# Altium schematic sheet ELC102 - Switch Interface.SchDoc
size D
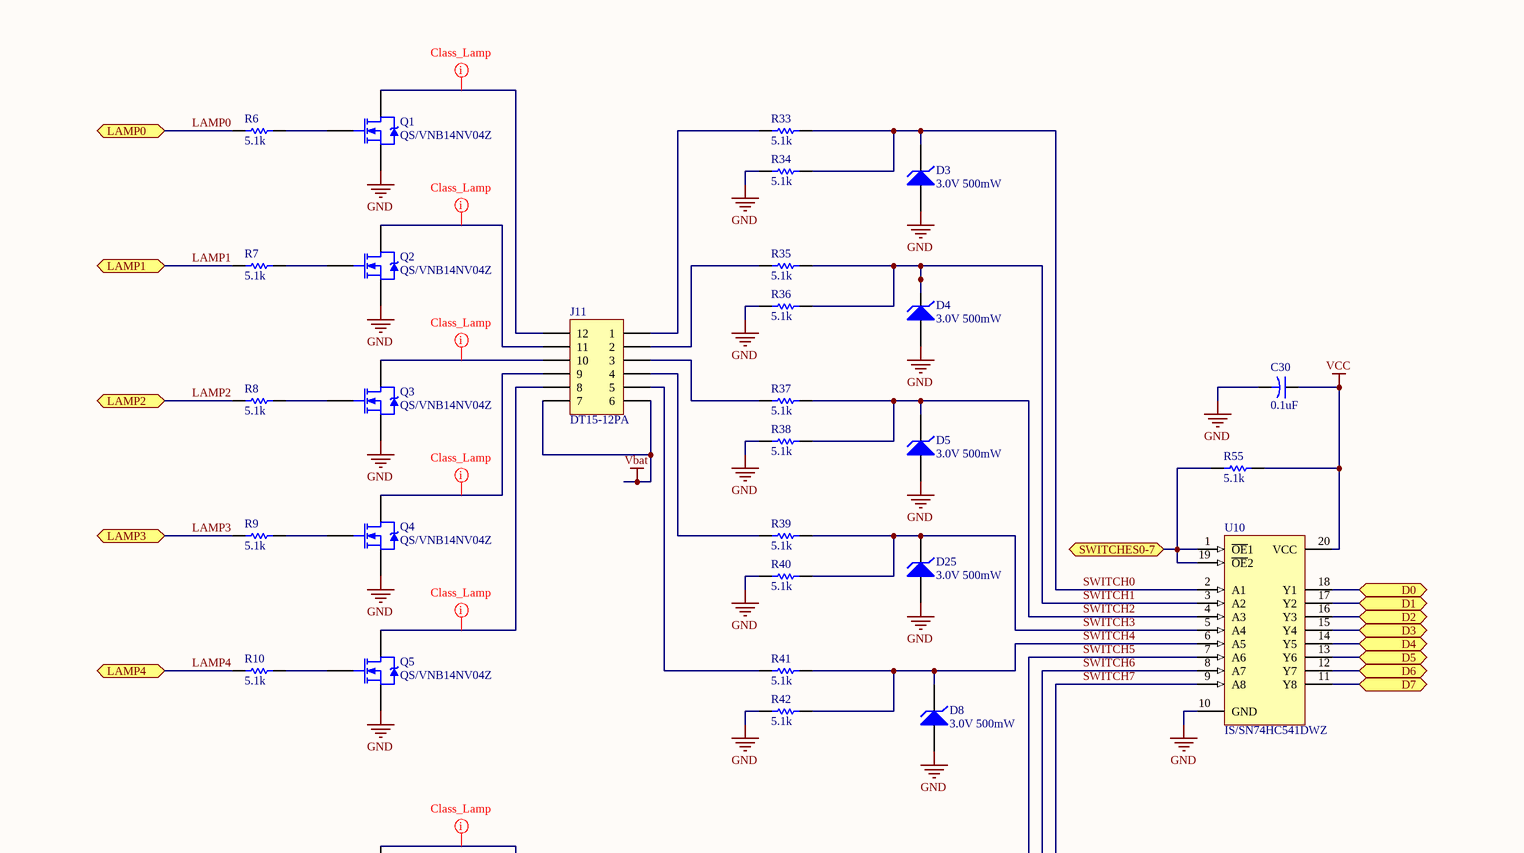
[diagram p0: ELC102 - Switch Interface.SchDoc, top left]
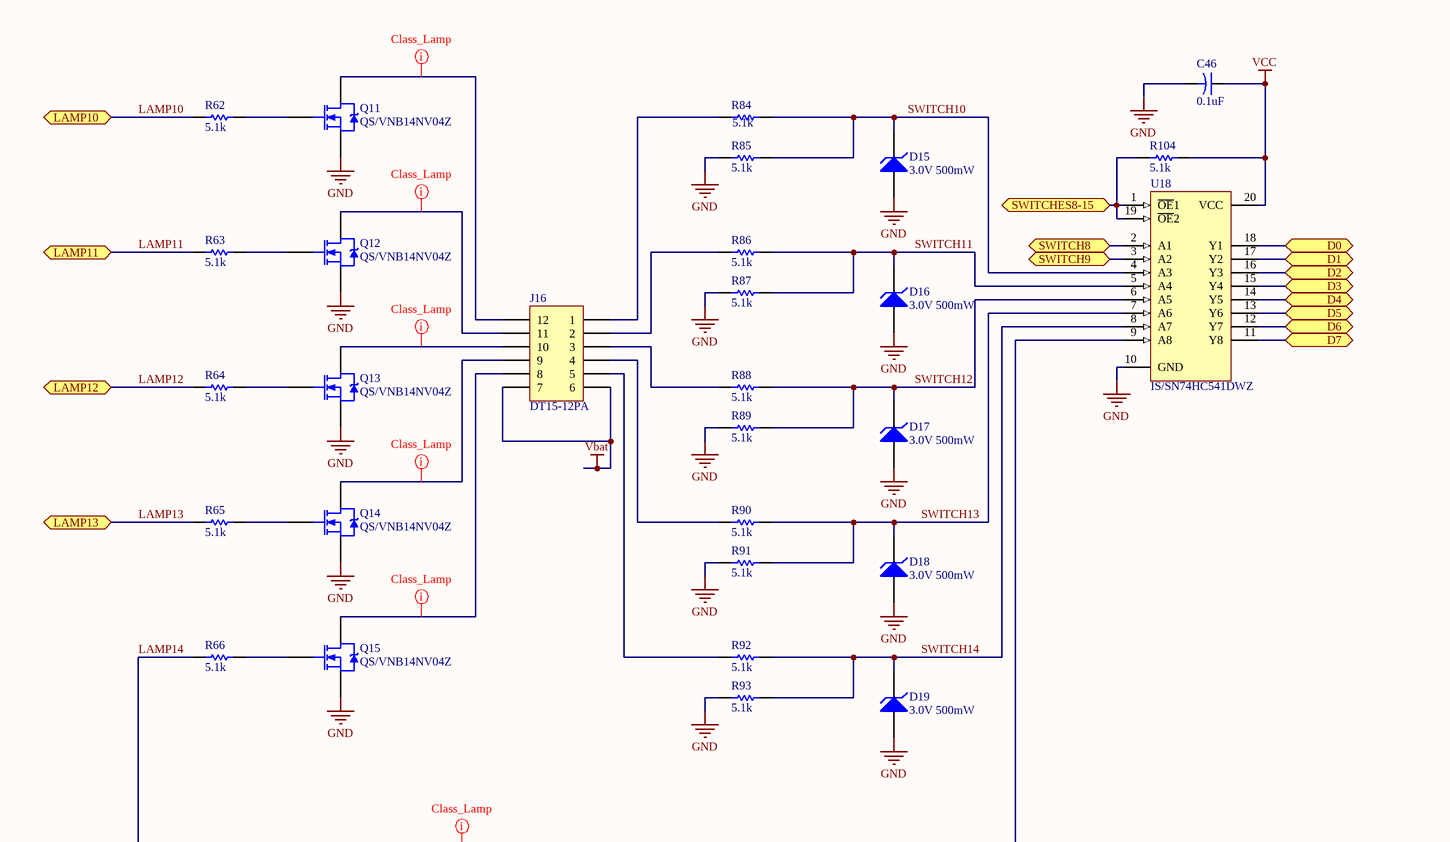
[diagram p1: ELC102 - Switch Interface.SchDoc, top right]
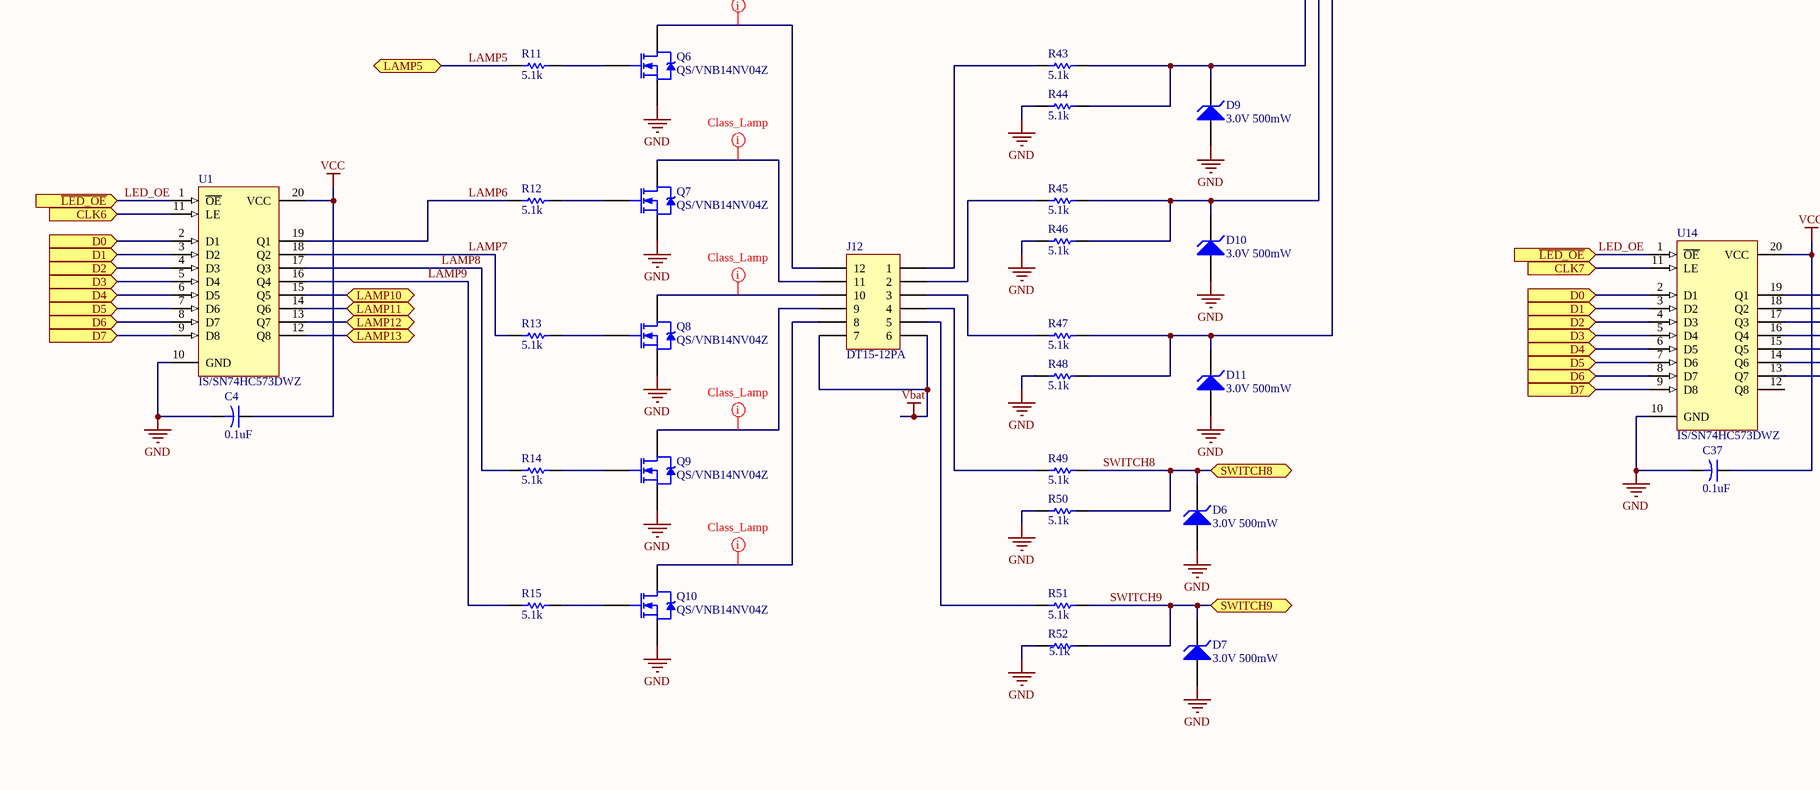
[diagram p2: ELC102 - Switch Interface.SchDoc, bottom left]
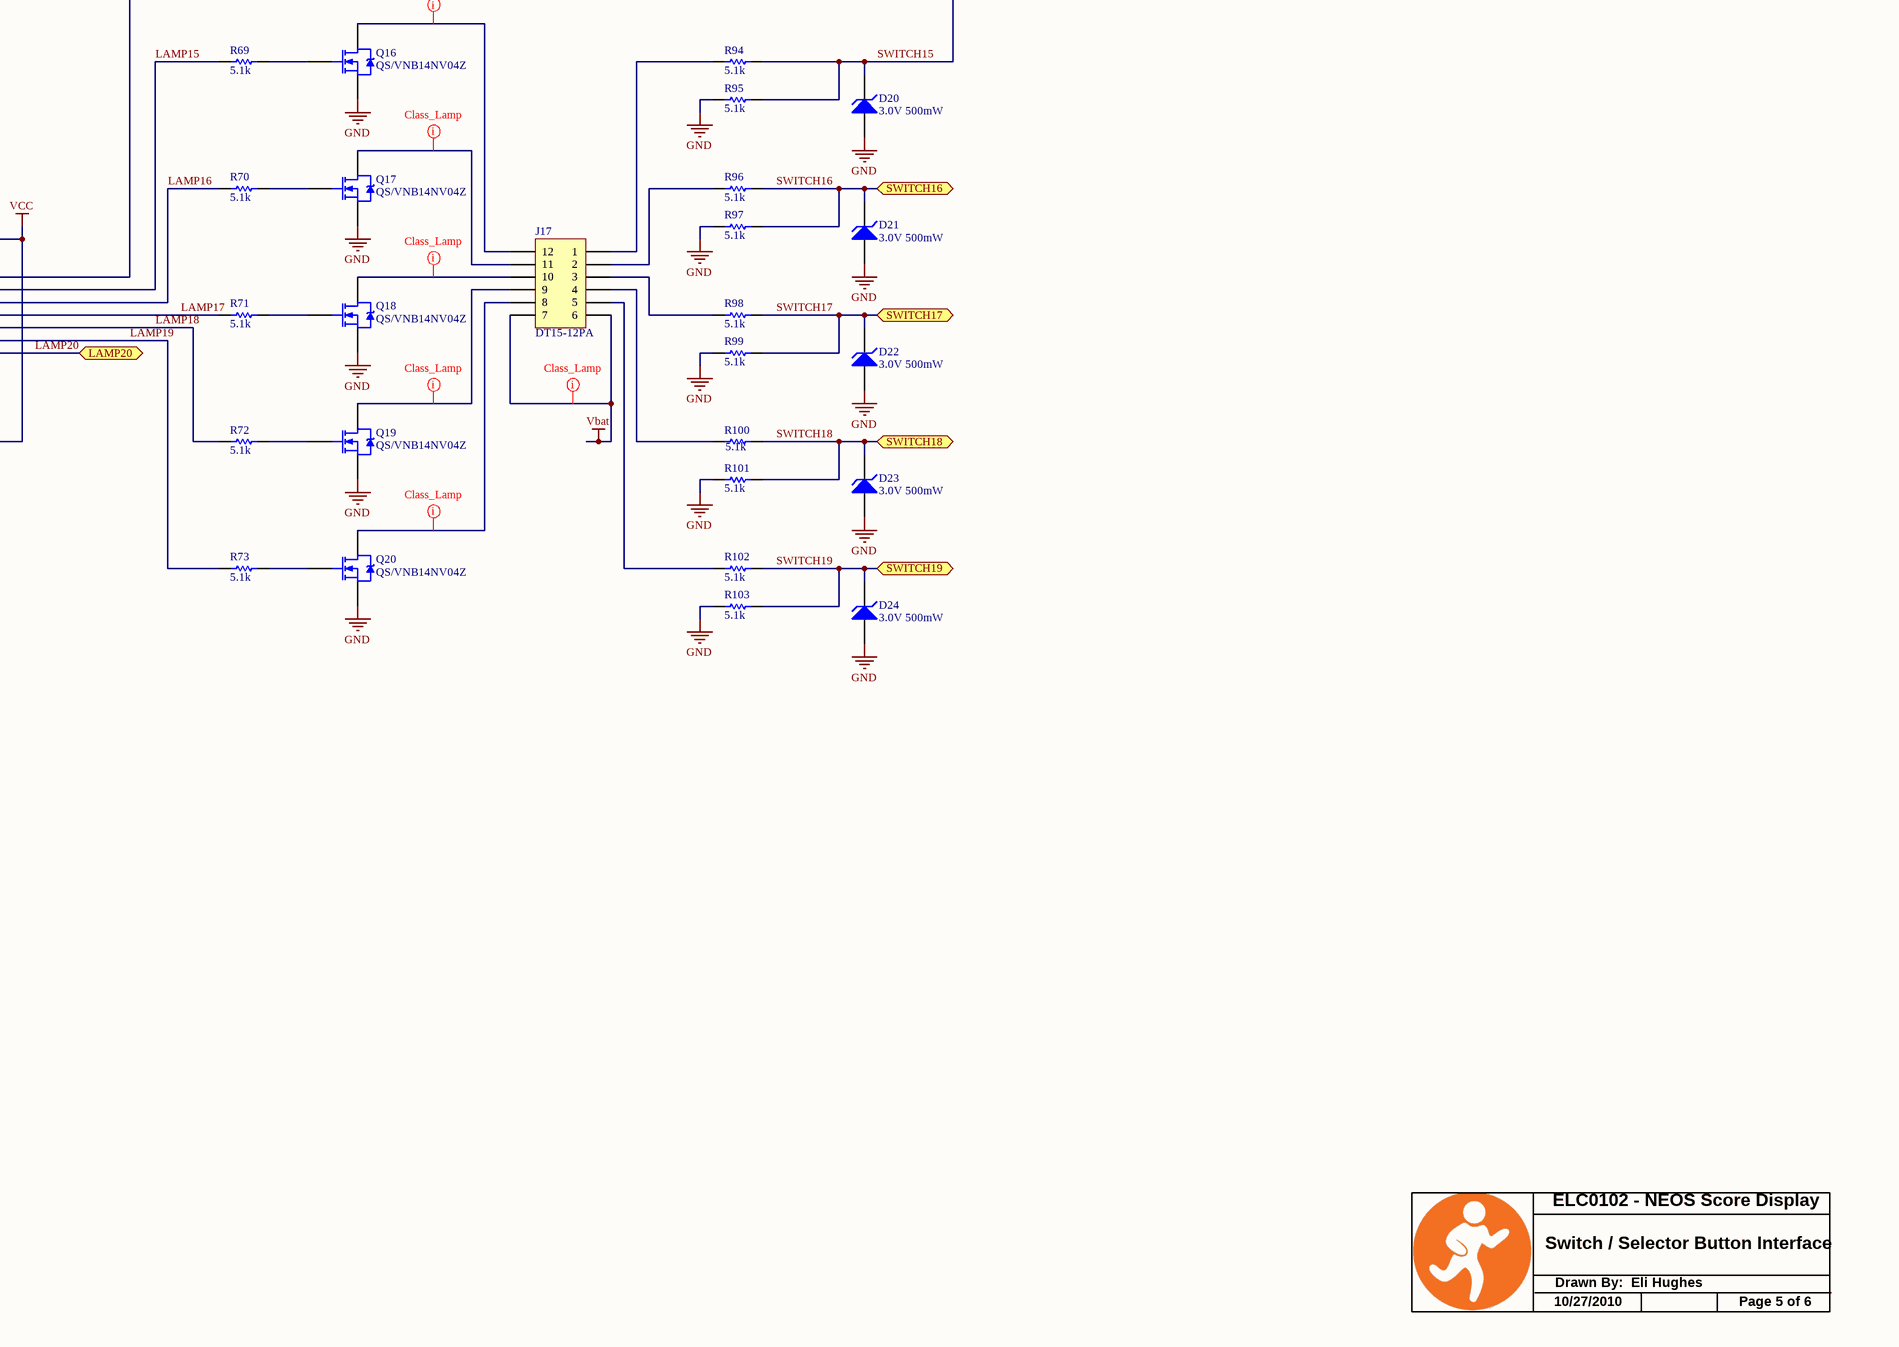
[diagram p3: ELC102 - Switch Interface.SchDoc, bottom right]

## Parts
C4  0.1uF  [C0805]
C30  0.1uF  [C0805]
C37  0.1uF  [C0805]
C46  0.1uF  [C0805]
D3  3.0V 500mW  [SOD123]
D4  3.0V 500mW  [SOD123]
D5  3.0V 500mW  [SOD123]
D6  3.0V 500mW  [SOD123]
D7  3.0V 500mW  [SOD123]
D8  3.0V 500mW  [SOD123]
D9  3.0V 500mW  [SOD123]
D10  3.0V 500mW  [SOD123]
D11  3.0V 500mW  [SOD123]
D15  3.0V 500mW  [SOD123]
D16  3.0V 500mW  [SOD123]
D17  3.0V 500mW  [SOD123]
D18  3.0V 500mW  [SOD123]
D19  3.0V 500mW  [SOD123]
D20  3.0V 500mW  [SOD123]
D21  3.0V 500mW  [SOD123]
D22  3.0V 500mW  [SOD123]
D23  3.0V 500mW  [SOD123]
D24  3.0V 500mW  [SOD123]
D25  3.0V 500mW  [SOD123]
J11  DT15-12PA  [JDT1512PA00Z]
J12  DT15-12PA  [JDT1512PA00Z]
J16  DT15-12PA  [JDT1512PA00Z]
J17  DT15-12PA  [JDT1512PA00Z]
Q1  QS/VNB14NV04Z  [D2PAK]
Q2  QS/VNB14NV04Z  [D2PAK]
Q3  QS/VNB14NV04Z  [D2PAK]
Q4  QS/VNB14NV04Z  [D2PAK]
Q5  QS/VNB14NV04Z  [D2PAK]
Q6  QS/VNB14NV04Z  [D2PAK]
Q7  QS/VNB14NV04Z  [D2PAK]
Q8  QS/VNB14NV04Z  [D2PAK]
Q9  QS/VNB14NV04Z  [D2PAK]
Q10  QS/VNB14NV04Z  [D2PAK]
Q11  QS/VNB14NV04Z  [D2PAK]
Q12  QS/VNB14NV04Z  [D2PAK]
Q13  QS/VNB14NV04Z  [D2PAK]
Q14  QS/VNB14NV04Z  [D2PAK]
Q15  QS/VNB14NV04Z  [D2PAK]
Q16  QS/VNB14NV04Z  [D2PAK]
Q17  QS/VNB14NV04Z  [D2PAK]
Q18  QS/VNB14NV04Z  [D2PAK]
Q19  QS/VNB14NV04Z  [D2PAK]
Q20  QS/VNB14NV04Z  [D2PAK]
R6  5.1k  [R0805]
R7  5.1k  [R0805]
R8  5.1k  [R0805]
R9  5.1k  [R0805]
R10  5.1k  [R0805]
R11  5.1k  [R0805]
R12  5.1k  [R0805]
R13  5.1k  [R0805]
R14  5.1k  [R0805]
R15  5.1k  [R0805]
R33  5.1k  [R0805]
R34  5.1k  [R0805]
R35  5.1k  [R0805]
R36  5.1k  [R0805]
R37  5.1k  [R0805]
R38  5.1k  [R0805]
R39  5.1k  [R0805]
R40  5.1k  [R0805]
R41  5.1k  [R0805]
R42  5.1k  [R0805]
R43  5.1k  [R0805]
R44  5.1k  [R0805]
R45  5.1k  [R0805]
R46  5.1k  [R0805]
R47  5.1k  [R0805]
R48  5.1k  [R0805]
R49  5.1k  [R0805]
R50  5.1k  [R0805]
R51  5.1k  [R0805]
R52  5.1k  [R0805]
R55  5.1k  [R0805]
R62  5.1k  [R0805]
R63  5.1k  [R0805]
R64  5.1k  [R0805]
R65  5.1k  [R0805]
R66  5.1k  [R0805]
R69  5.1k  [R0805]
R70  5.1k  [R0805]
R71  5.1k  [R0805]
R72  5.1k  [R0805]
R73  5.1k  [R0805]
R84  5.1k  [R0805]
R85  5.1k  [R0805]
R86  5.1k  [R0805]
R87  5.1k  [R0805]
R88  5.1k  [R0805]
R89  5.1k  [R0805]
R90  5.1k  [R0805]
R91  5.1k  [R0805]
R92  5.1k  [R0805]
R93  5.1k  [R0805]
R94  5.1k  [R0805]
R95  5.1k  [R0805]
R96  5.1k  [R0805]
R97  5.1k  [R0805]
R98  5.1k  [R0805]
R99  5.1k  [R0805]
R100  5.1k  [R0805]
R101  5.1k  [R0805]
R102  5.1k  [R0805]
R103  5.1k  [R0805]
R104  5.1k  [R0805]
U1  IS/SN74HC573DWZ  [SOIC300-20]
U10  IS/SN74HC541DWZ  [SOIC300-20]
U14  IS/SN74HC573DWZ  [SOIC300-20]
U18  IS/SN74HC541DWZ  [SOIC300-20]

## Ports
CLK6 (in), CLK7 (in), D0, D0 (in), D1, D1 (in), D2, D2 (in), D3, D3 (in), D4, D4 (in), D5, D5 (in), D6, D6 (in), D7, D7 (in), LAMP0, LAMP1, LAMP2, LAMP3, LAMP4, LAMP5, LAMP10, LAMP11, LAMP12, LAMP13, LAMP20, SWITCH8, SWITCH9, SWITCH16, SWITCH17, SWITCH18, SWITCH19, SWITCHES0-7, SWITCHES8-15, ~{LED_OE} (in)

## Nets
GND: C4.2 C30.2 C37.2 C46.2 D3.1(A) D4.1(A) D5.1(A) D6.1(A) D7.1(A) D8.1(A) D9.1(A) D10.1(A) D11.1(A) D15.1(A) D16.1(A) D17.1(A) D18.1(A) D19.1(A) D20.1(A) D21.1(A) D22.1(A) D23.1(A) D24.1(A) D25.1(A) Q1.3(S) Q2.3(S) Q3.3(S) Q4.3(S) Q5.3(S) Q6.3(S) Q7.3(S) Q8.3(S) Q9.3(S) Q10.3(S) Q11.3(S) Q12.3(S) Q13.3(S) Q14.3(S) Q15.3(S) Q16.3(S) Q17.3(S) Q18.3(S) Q19.3(S) Q20.3(S) R34.2 R36.2 R38.2 R40.2 R42.2 R44.2 R46.2 R48.2 R50.2 R52.2 R85.2 R87.2 R89.2 R91.2 R93.2 R95.2 R97.2 R99.2 R101.2 R103.2 U1.10(GND) U10.10(GND) U14.10(GND) U18.10(GND)
Vbat: J11.6 J11.7 J12.6 J12.7 J16.6 J16.7 J17.6 J17.7
VCC: C4.1 C30.1 C37.1 C46.1 R55.1 R104.1 U1.20(VCC) U10.20(VCC) U14.20(VCC) U18.20(VCC)
CLK6: U1.11(LE) ; port CLK6
CLK7: U14.11(LE) ; port CLK7
D0: U1.2(D1) U10.18(Y1) U14.2(D1) U18.18(Y1) ; port D0
D1: U1.3(D2) U10.17(Y2) U14.3(D2) U18.17(Y2) ; port D1
D2: U1.4(D3) U10.16(Y3) U14.4(D3) U18.16(Y3) ; port D2
D3: U1.5(D4) U10.15(Y4) U14.5(D4) U18.15(Y4) ; port D3
D4: U1.6(D5) U10.14(Y5) U14.6(D5) U18.14(Y5) ; port D4
D5: U1.7(D6) U10.13(Y6) U14.7(D6) U18.13(Y6) ; port D5
D6: U1.8(D7) U10.12(Y7) U14.8(D7) U18.12(Y7) ; port D6
D7: U1.9(D8) U10.11(Y8) U14.9(D8) U18.11(Y8) ; port D7
LAMP0: R6.1 ; port LAMP0
LAMP1: R7.1 ; port LAMP1
LAMP2: R8.1 ; port LAMP2
LAMP3: R9.1 ; port LAMP3
LAMP4: R10.1 ; port LAMP4
LAMP5: R11.1 ; port LAMP5
LAMP6: R12.1 U1.19(Q1)
LAMP7: R13.1 U1.18(Q2)
LAMP8: R14.1 U1.17(Q3)
LAMP9: R15.1 U1.16(Q4)
LAMP10: R62.1 U1.15(Q5) ; port LAMP10
LAMP11: R63.1 U1.14(Q6) ; port LAMP11
LAMP12: R64.1 U1.13(Q7) ; port LAMP12
LAMP13: R65.1 U1.12(Q8) ; port LAMP13
LAMP14: R66.1 U14.19(Q1)
LAMP15: R69.1 U14.18(Q2)
LAMP16: R70.1 U14.17(Q3)
LAMP17: R71.1 U14.16(Q4)
LAMP18: R72.1 U14.15(Q5)
LAMP19: R73.1 U14.14(Q6)
LAMP20: U14.13(Q7) ; port LAMP20
LED_OE: U1.1(~{OE}) U14.1(~{OE}) ; port ~{LED_OE}
SWITCH0: D3.2(K) R33.1 R34.1 U10.2(A1)
SWITCH1: D4.2(K) R35.1 R36.1 U10.3(A2)
SWITCH2: D5.2(K) R37.1 R38.1 U10.4(A3)
SWITCH3: D25.2(K) R39.1 R40.1 U10.5(A4)
SWITCH4: D8.2(K) R41.1 R42.1 U10.6(A5)
SWITCH5: D9.2(K) R43.1 R44.1 U10.7(A6)
SWITCH6: D10.2(K) R45.1 R46.1 U10.8(A7)
SWITCH7: D11.2(K) R47.1 R48.1 U10.9(A8)
SWITCH8: D6.2(K) R49.1 R50.1 U18.2(A1) ; port SWITCH8
SWITCH9: D7.2(K) R51.1 R52.1 U18.3(A2) ; port SWITCH9
SWITCH10: D15.2(K) R84.1 R85.1 U18.4(A3)
SWITCH11: D16.2(K) R86.1 R87.1 U18.5(A4)
SWITCH12: D17.2(K) R88.1 R89.1 U18.6(A5)
SWITCH13: D18.2(K) R90.1 R91.1 U18.7(A6)
SWITCH14: D19.2(K) R92.1 R93.1 U18.8(A7)
SWITCH15: D20.2(K) R94.1 R95.1 U18.9(A8)
SWITCH16: D21.2(K) R96.1 R97.1 ; port SWITCH16
SWITCH17: D22.2(K) R98.1 R99.1 ; port SWITCH17
SWITCH18: D23.2(K) R100.1 R101.1 ; port SWITCH18
SWITCH19: D24.2(K) R102.1 R103.1 ; port SWITCH19
SWITCHES0-7: R55.2 U10.1(~{OE}1) U10.19(~{OE}2) ; port SWITCHES0-7
SWITCHES8-15: R104.2 U18.1(~{OE}1) U18.19(~{OE}2) ; port SWITCHES8-15
NetJ11_1: J11.1 R33.2
NetJ11_2: J11.2 R35.2
NetJ11_3: J11.3 R37.2
NetJ11_4: J11.4 R39.2
NetJ11_5: J11.5 R41.2
NetJ11_8: J11.8 Q5.2(D)
NetJ11_9: J11.9 Q4.2(D)
NetJ11_10: J11.10 Q3.2(D)
NetJ11_11: J11.11 Q2.2(D)
NetJ11_12: J11.12 Q1.2(D)
NetJ12_1: J12.1 R43.2
NetJ12_2: J12.2 R45.2
NetJ12_3: J12.3 R47.2
NetJ12_4: J12.4 R49.2
NetJ12_5: J12.5 R51.2
NetJ12_8: J12.8 Q10.2(D)
NetJ12_9: J12.9 Q9.2(D)
NetJ12_10: J12.10 Q8.2(D)
NetJ12_11: J12.11 Q7.2(D)
NetJ12_12: J12.12 Q6.2(D)
NetJ16_1: J16.1 R84.2
NetJ16_2: J16.2 R86.2
NetJ16_3: J16.3 R88.2
NetJ16_4: J16.4 R90.2
NetJ16_5: J16.5 R92.2
NetJ16_8: J16.8 Q15.2(D)
NetJ16_9: J16.9 Q14.2(D)
NetJ16_10: J16.10 Q13.2(D)
NetJ16_11: J16.11 Q12.2(D)
NetJ16_12: J16.12 Q11.2(D)
NetJ17_1: J17.1 R94.2
NetJ17_2: J17.2 R96.2
NetJ17_3: J17.3 R98.2
NetJ17_4: J17.4 R100.2
NetJ17_5: J17.5 R102.2
NetJ17_8: J17.8 Q20.2(D)
NetJ17_9: J17.9 Q19.2(D)
NetJ17_10: J17.10 Q18.2(D)
NetJ17_11: J17.11 Q17.2(D)
NetJ17_12: J17.12 Q16.2(D)
NetQ1_1: Q1.1(G) R6.2
NetQ2_1: Q2.1(G) R7.2
NetQ3_1: Q3.1(G) R8.2
NetQ4_1: Q4.1(G) R9.2
NetQ5_1: Q5.1(G) R10.2
NetQ6_1: Q6.1(G) R11.2
NetQ7_1: Q7.1(G) R12.2
NetQ8_1: Q8.1(G) R13.2
NetQ9_1: Q9.1(G) R14.2
NetQ10_1: Q10.1(G) R15.2
NetQ11_1: Q11.1(G) R62.2
NetQ12_1: Q12.1(G) R63.2
NetQ13_1: Q13.1(G) R64.2
NetQ14_1: Q14.1(G) R65.2
NetQ15_1: Q15.1(G) R66.2
NetQ16_1: Q16.1(G) R69.2
NetQ17_1: Q17.1(G) R70.2
NetQ18_1: Q18.1(G) R71.2
NetQ19_1: Q19.1(G) R72.2
NetQ20_1: Q20.1(G) R73.2

Not connected (* = marked no-connect by the designer): U14 12(Q8)

## Layout directives
net class Class_Lamp: NetJ11_8, NetJ11_9, NetJ11_10, NetJ11_11, NetJ11_12, NetJ12_8, NetJ12_9, NetJ12_10, NetJ12_11, NetJ12_12, NetJ16_8, NetJ16_9, NetJ16_10, NetJ16_11, NetJ16_12, NetJ17_8, NetJ17_9, NetJ17_10, NetJ17_11, NetJ17_12, Vbat

## Notes on the sheet
- Switch / Selector Button Interface
- ELC0102 - NEOS Score Display
- 10/27/2010
- Drawn By:  Eli Hughes
- Page 5 of 6

## Library data of the parts
C4 C30 C37 C46 = CS/C0805C104K5RACK: Kemet .1uF 0805; Manufacturer Part Number: C0805C104K5RACTU; Source Part Number: 399-1170-2-ND; Description: CAP .10UF 50V CERAMIC X7R 0805; Capacitance: 0.1µF; Voltage - Rated: 50V; Tolerance: ±10%; Temperature Coefficient: X7R; Manufacturer: Kemet; ROHS Certificate: Lead free / RoHS compliant; Source: Digikey; Value: 0.1uF; Supplier 1: Digi-Key; RoHS: RoHS Compliant; Category: Capacitors; Stock 1: 10120790; Pricing 1: 10=0.105, 100=0.0378, 250=0.02732, 500=0.02016, 1000=0.01365 (USD); Mounting Type: Surface Mount, MLCC; Operating Temperature: -55°C ~ 125°C; Features: -; Applications: General Purpose; Ratings: -; Package / Case: 0805 (2012 Metric); Size / Dimension: 0.079" L x 0.049" W (2.00mm x 1.25mm); Lead Spacing: -; Thickness: 0.90mm; Packaging: Cut Tape (CT); Lead Style: -; ComponentLink1URL: http://www.kemet.com/datasheets&C0805C104K5RACTU; ComponentLink1Description: http://www.kemet.com/datasheets&C0805C104K5RACTU; Supplier Part Number 1: 399-1170-1-ND
D3-D11 D15-D25 = DS/MMSZ5225BT1Z: Zener 3.0V SOD-123; Manufacturer: ON Semiconductor; Manufacturer Part Number: MMSZ5225BT1G; Source Part Number: MMSZ5225BT1GOSCT-ND; Value: MMSZ5225BT1G; Description: DIODE ZENER 3V 500MW SOD-123; Voltage - Zener (Nom) (Vz): 3V; Voltage - Forward (Vf) (Max) @ If: 900mV @ 10mA; Current - Reverse Leakage @ Vr: 50µA @ 1V; Tolerance: ±5%; Impedance (Max) (Zzt): 29 Ohm; ROHS Certificate: Lead free / RoHS compliant; Source: Digikey; Supplier 1: Digi-Key; RoHS: RoHS Compliant; Category: Discrete Semiconductor Products; Stock 1: 27337; Pricing 1: 1=0.52, 10=0.356, 100=0.1676, 250=0.1194, 500=0.09114, 1000=0.06285 (USD); Power - Max: 500mW; Mounting Type: Surface Mount; Package / Case: SOD-123; Packaging: Cut Tape (CT); Operating Temperature: -55°C ~ 150°C; Supplier Device Package: SOD-123; ComponentLink1URL: http://www.onsemi.com/pub_link/Collateral/MMSZ5221BT1-D.PDF; ComponentLink1Description: http://www.onsemi.com/pub_link/Collateral/MMSZ5221BT1-D.PDF; Supplier Part Number 1: MMSZ5225BT1GOSCT-ND
J11 J12 J16 J17 = JDT1512PA00Z: Deutsch 12P Sealed PCB connector; Manufacturer: Deutsch; Manufacturer Part Number: DT15-12PA; ROHS Certificate: ROHS Compliant; Value: DT15-12PA; Supplier 1: LADD Industries Inc.; Supplier Part Number 1: DT15-12PA
Q1-Q20 = QS/VNB14NV04Z: HEXFET Power MOSFET; Manufacturer: STMicroelectronics; Source Part Number: VNB14NV04-ND; Description: MOSFET POWER 40V 12A D2PAK; Type: Low Side; Input Type: Non-Inverting; Number of Outputs: 1; On-State Resistance: 35 mOhm; Current - Peak Output: 18A; Manufacturer Part Number: VNB14NV04; ROHS Certificate: Lead free / RoHS compliant; Source: Digikey; Value: VNB14NV04; Supplier 1: Digi-Key; RoHS: RoHS Compliant; Category: Integrated Circuits (ICs); Stock 1: 0; Pricing 1: 800=1.5495 (USD); Current - Output / Channel: -; Voltage - Supply: -; Operating Temperature: -; Mounting Type: Surface Mount; Package / Case: TO-263-2, D²Pak (2 leads + Tab), TO-263AB; Packaging: Tube; Supplier Device Package: *; ComponentLink1URL: http://www.st.com/stonline/products/literature/ds/1643/vnb14n04.pdf; ComponentLink1Description: http://www.st.com/stonline/products/literature/ds/1643/vnb14n04.pdf; Supplier Part Number 1: VNB14NV04-ND
R6-R15 R33-R52 R55 R62-R66 R69-R73 R84-R104 = ERJ-6ENF5101V: RES 5.10K OHM 1/8W 1% 0805 SMD; Manufacturer: Panasonic - ECG; Power (Watts): 0.125W, 1/8W; Temperature Coefficient: ±100ppm/°C; ComponentLink1Description: http://industrial.panasonic.com/www-cgi/jvcr13pz.cgi?E+PZ+3+AOA0002+ERJ6ENF5101V+7+WW; ComponentLink1URL: http://industrial.panasonic.com/www-cgi/jvcr13pz.cgi?E+PZ+3+AOA0002+ERJ6ENF5101V+7+WW; Value: 5.1k; Supplier 1: Digi-Key; Manufacturer Part Number: ERJ-6ENF5101V; RoHS: RoHS Compliant; Category: Resistors; Stock 1: 32293; Pricing 1: 1=0.07, 50=0.0276, 100=0.021, 250=0.0156, 500=0.01152, 1000=0.00768 (USD); Resistance In Ohms: 5.10K; Composition: Thick Film; Features: -; Tolerance: ±1%; Case: 0805 (2012 metric); Size / Dimension: 0.079" L x 0.049" W (2.00mm x 1.25mm); Height: 0.024" (0.60mm); Lead Style: Surface Mount (SMD - SMT); Packaging: Digi-Reel®; Supplier Part Number 1: P5.10KCDKR-ND
U1 U14 = IS/SN74HC573DWZ: Octal D-Type Transparent Latch with 3-State Outputs; Manufacturer: NXP Semiconductors; Manufacturer Part Number: 74HC573D-T; Source Part Number: 568-1477-2-ND; Value: 74HC573D-T; Description: IC LATCH OCTAL D 3STATE 20SOIC; Circuit: 8:8; Output Type: Tri-State; Voltage - Supply: 2 V ~ 6 V; Independent Circuits: 1; Delay Time - Propagation: 14ns; Current - Output High, Low: 7.8mA, 7.8mA; ROHS Certificate: Lead free / RoHS compliant; Source: Digikey; Supplier 1: Digi-Key; RoHS: RoHS Compliant; Category: Integrated Circuits (ICs); Stock 1: 46803; Pricing 1: 1=0.84, 25=0.646, 100=0.57, 250=0.494, 500=0.418 (USD); Logic Type: D-Type Transparent Latch; Operating Temperature: -40°C ~ 125°C; Mounting Type: Surface Mount; Package / Case: 20-SOIC (0.300", 7.50mm Width); Packaging: Cut Tape (CT); Supplier Device Package: 20-SOIC; ComponentLink1URL: http://www.nxp.com/documents/data_sheet/74HC_HCT573.pdf; ComponentLink1Description: http://www.nxp.com/documents/data_sheet/74HC_HCT573.pdf; Supplier Part Number 1: 568-1477-1-ND
U10 U18 = IS/SN74HC541DWZ: Octal Buffer and Line Driver with 3-State Outputs; Manufacturer: Texas Instruments; Manufacturer Part Number: SN74HC541DWR; Source Part Number: 296-1202-2-ND; Value: SN74HC541DWR; Description: IC BUFF/DVR TRI-ST 8BIT 20SOIC; Logic Type: Buffer/Line Driver, Non-Inverting; Number of Elements: 1; Number of Bits per Element: 8; Current - Output High, Low: 7.8mA, 7.8mA; Voltage - Supply: 2 V ~ 6 V; ROHS Certificate: Lead free / RoHS compliant; Source: Digikey; Supplier 1: Digi-Key; RoHS: RoHS Compliant; Category: Integrated Circuits (ICs); Stock 1: 8100; Pricing 1: 1=0.72, 25=0.5004, 100=0.429, 250=0.37052, 500=0.3185, 1000=0.247 (USD); Operating Temperature: -40°C ~ 85°C; Mounting Type: Surface Mount; Package / Case: 20-SOIC (0.300", 7.50mm Width); Packaging: Cut Tape (CT); Supplier Device Package: *; ComponentLink1URL: http://focus.ti.com/lit/ds/symlink/sn74hc541.pdf; ComponentLink1Description: http://focus.ti.com/lit/ds/symlink/sn74hc541.pdf; Supplier Part Number 1: 296-1202-1-ND